# EAGLE design Amplifier2450 (EAGLE 9.6.2)
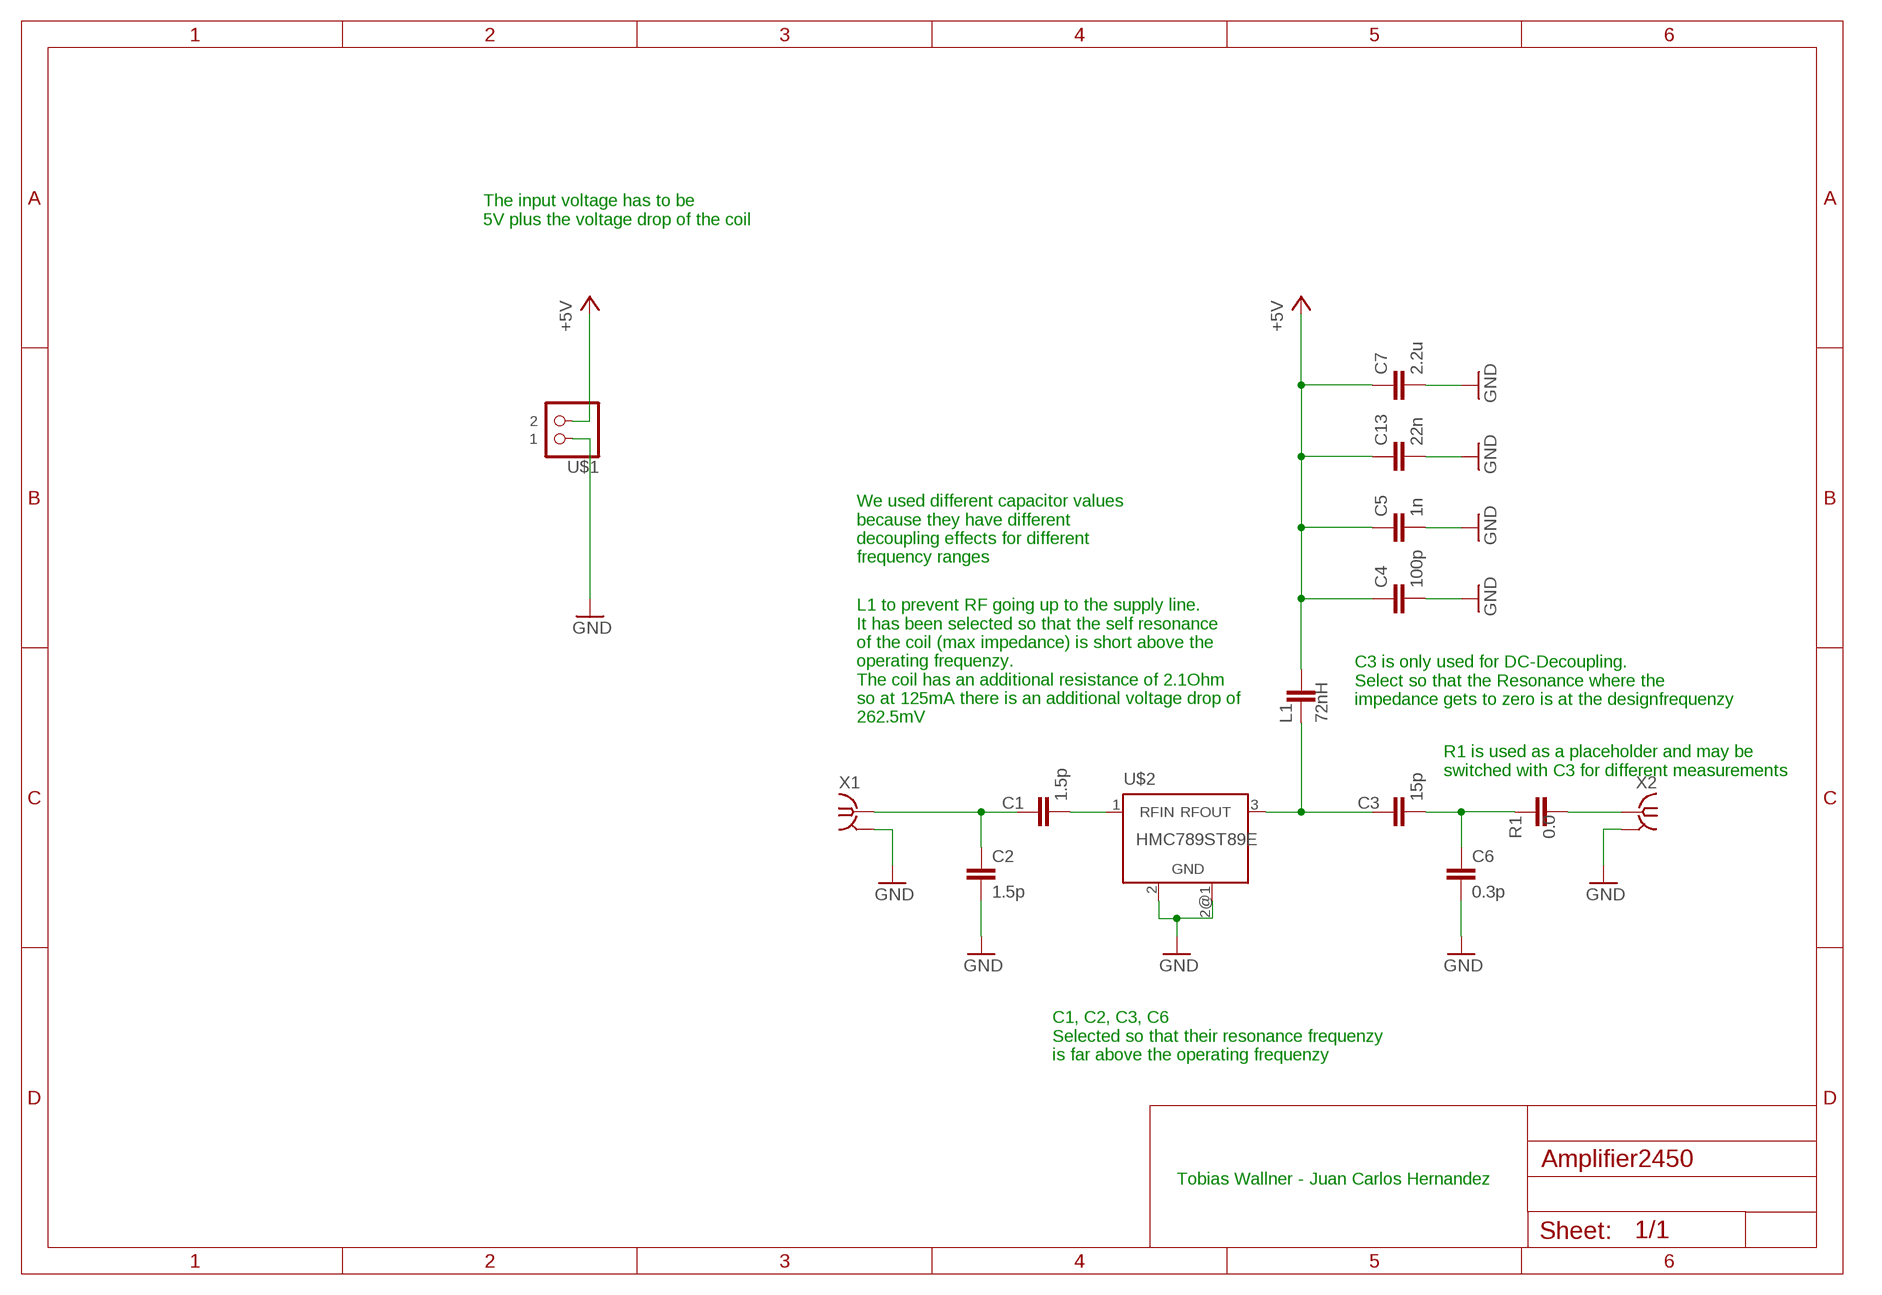
[diagram p0: schematic, sheet 1]

## Parts
C1  1.5p  C-EUC0603  [C0603]
C2  1.5p  C-EUC0603  [C0603]
C3  15p  C-EUC0603  [C0603]
C4  100p  C-EUC0603  [C0603]
C5  1n  C-EUC0603  [C0603]
C6  0.3p  C-EUC0603  [C0603]
C7  2.2u  C-EUC0805  [C0805]
C13  22n  C-EUC0603  [C0603]
L1  72nH  C-EUC0603  [C0603]
R1  0.0  C-EUC0603  [C0603]
U$1  SKB_1X02_RM_5.12  [RM_5.12_1X02]
U$2  HMC789ST89E  [SOT89]
X1  SMA-142-0701-801/806  [J502-ND-142-0701-801/806]
X2  SMA-142-0701-801/806  [J502-ND-142-0701-801/806]

## Nets
+5V: C4.1 C5.1 C7.1 C13.1 L1.1 U$1.P$2
GND: C2.2 C4.2 C5.2 C6.2 C7.2 C13.2 U$1.P$1 U$2.2(GND) U$2.2@1(GND) X1.G@1 X1.G@2 X1.G@3 X1.G@4 X2.G@1 X2.G@2 X2.G@3 X2.G@4
N$1: C3.1 L1.2 U$2.3(RFOUT)
N$2: C1.1 C2.1 X1.1
N$3: C1.2 U$2.1(RFIN)
N$4: C3.2 C6.1 R1.1
N$5: R1.2 X2.1

## Notes on the sheet
- The input voltage has to be 
  5V plus the voltage drop of the coil
- We used different capacitor values 
  because they have different 
  decoupling effects for different
  frequency ranges
- C3 is only used for DC-Decoupling.
  Select so that the Resonance where the
  impedance gets to zero is at the designfrequenzy
- L1 to prevent RF going up to the supply line.
  It has been selected so that the self resonance 
  of the coil (max impedance) is short above the
  operating frequenzy.
  The coil has an additional resistance of 2.1Ohm
  so at 125mA there is an additional voltage drop of 
  262.5mV
- R1 is used as a placeholder and may be
  switched with C3 for different measurements
- C1, C2, C3, C6
  Selected so that their resonance frequenzy
  is far above the operating frequenzy
- Tobias Wallner - Juan Carlos Hernandez

## Library data of the parts
C1-C7 C13 L1 R1 = rcl:C-EU: CAPACITOR, European symbol; SPICEPREFIX: C
U$1 = own_Schraubklemmblock:SKB_1X02; RM: 5.12
U$2 = HMC789ST89E:HMC789ST89E
X1 X2 = con-coax:SMA-: SMA 50 Ohm End Launch Jack Receptacle - Round Contact Johnson Components Source: www.johnsoncomponents.com .. J502-ND.pdf; MF: JOHNSON COMPONENTS; MPN: 142-0701-801; OC_FARNELL: 1608592; OC_NEWARK: 90F2624

## Board
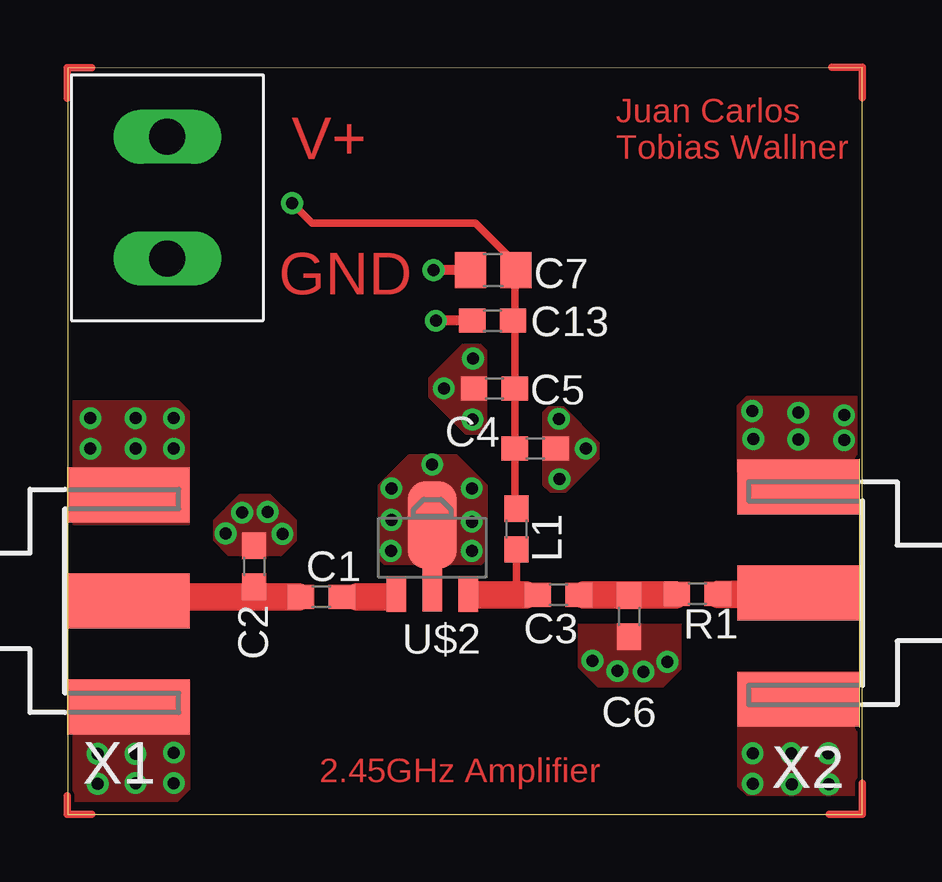
[diagram p1: board, top side]
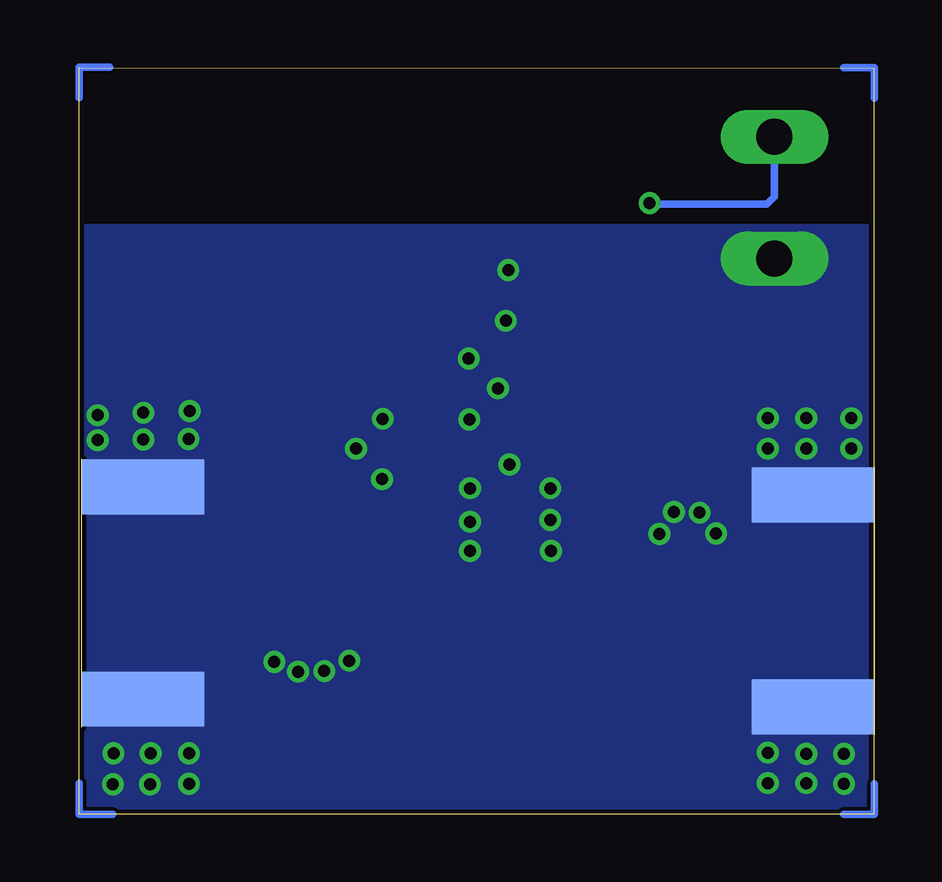
[diagram p2: board, bottom side, seen from below]

Size 33.15 x 31.13 mm. Coordinates in mm from the lower left corner, seen from the top.
Outline: 0.02,0 33.15,0 33.15,31.13 0.02,31.11 0.02,0
Copper layers (1*16): Top 0.035mm / dielectric 1.5mm / Bottom 0.035mm
Design rules "default *": minimum track width 6mil, minimum drill 0.35mm, track to track 6mil, track to pad 6mil, pad to pad 6mil, via to via 6mil, smd to smd 6mil, copper to edge 0.2mm, drill to drill 6mil, minimum pad ring 10mil, minimum via ring 8mil, stop-mask expansion 4mil, vias tented up to drill 0mil, thermal gap 0mil

### Footprints (pad centres in the part's own frame; a part is rotated, then mirrored left to right if it is on the bottom)
C0603 = smd 1.1 x 1: 1 -0.85,0; 2 0.85,0
C0805 = smd 1.3 x 1.5: 1 -0.95,0; 2 0.95,0
RM_5.12_1X02 = drill 1.5 long: P$1 -2.54,0; P$2 2.54,0
SOT89 = smd 0.8 x 1.4: 1 -1.499,-1.981; 3 1.499,-1.981 | smd 0.8 x 1.9: 2 0,-1.727 | smd 2.032 x 3.65: 2@1 0,0.94
J502-ND-142-0701-801/806 = smd 5.08 x 2.286: 1 2.565,0; G@1 2.565,4.42; G@2 2.565,-4.42 | smd 5.08 x 2.286 bottom: G@3 2.565,4.42; G@4 2.565,-4.42

### Placement (x,y rotation side)
C1  10.59,9.07 0 top
C2  7.8,10.34 90 top
C3  20.47,9.14 0 top
C4  19.51,15.24 0 top
C5  17.81,17.75 180 top
C6  23.42,8.26 270 top
C7  17.75,22.68 180 top
C13  17.73,20.57 180 top
L1  18.72,11.89 270 top
R1  26.26,9.19 0 top
U$1  4.17,25.7 90 top
U$2  15.21,11.13 0 top
X1  0,8.89 0 top
X2  33.05,9.22 180 top

### Tracks (layer width: path | path; a pad name or v marks a point on that pad's centre or on a via)
+5V  (via drill 0.5)
  Top 0.305: v9.37,25.48 10.21,24.64 17.02,24.64 18.62,23.04 18.62,22.7 C7.1 18.66,22.63 18.66,20.53 | C13.1 18.66,20.5 C5.1 C4.1 18.66,12.8 L1.1
  Top 0.508: 18.66,20.53 C13.1
  Bottom 0.305: U$1.P$2 4.17,25.76 4.5,25.43 9.32,25.43 v9.37,25.48
GND  (via drill 0.5)
  Top 0.254: U$2.2 15.21,10.82 15.09,10.95
  Top 0.406: C7.2 v15.26,22.68 | C13.2 v15.37,20.57
  other vias: 2.84,16.51 0.97,16.51 0.97,15.24 2.84,15.24 4.45,16.51 4.45,15.24 1.27,2.51 2.84,2.51 4.45,2.57 4.45,1.3 2.84,1.3 1.27,1.27 6.6,11.71 8.97,11.68 8.36,12.6 7.29,12.57 25.02,6.35 21.89,6.4 22.94,5.97 24.03,5.94 21.62,15.24 20.5,16.48 20.52,13.97 16.92,19 15.7,17.75 16.89,16.46 28.6,15.65 32.38,15.6 30.48,15.62 32.38,16.64 30.48,16.74 28.55,16.81 28.57,2.54 30.18,2.54 31.72,2.54 31.75,1.24 30.2,1.24 28.57,1.27 15.21,14.58 13.51,13.59 13.51,12.27 13.49,10.97 16.87,10.97 16.87,12.19 16.87,13.59
  pour Bottom: -1.27,24.54 -1.27,18.87 -1.27,-1.24 33.91,-1.24 33.91,24.54
  pour Top: 27.94,14.25 27.94,17.04 28.32,17.42 33.32,17.42 33.35,17.4 33.35,14.25
  pour Top: 27.94,3.84 27.94,1.17 28.32,0.79 32.89,0.79 33.15,1.04 33.15,3.84
  pour Top: 5.11,5.59 5.11,1.04 4.57,0.51 -0.25,0.51 -0.25,5.59
  pour Top: -0.05,12.06 -0.05,17.25 4.65,17.25 5.08,16.81 5.08,12.06
  pour Top: 9.55,11.4 9.55,12.24 8.46,13.34 7.19,13.34 6.07,12.22 6.07,11.43 6.71,10.79 8.94,10.79
  pour Top: 13.21,10.41 17.27,10.41 17.53,10.67 17.53,13.72 16.26,14.99 14.22,14.99 12.95,13.72 12.95,10.67
  pour Top: 21.29,7.92 25.6,7.92 25.6,6.05 24.84,5.28 22.12,5.28 21.29,6.12
  pour Top: 17.5,19.33 17.25,19.58 16.46,19.58 15.06,18.19 15.06,17.48 15.06,17.4 16.59,15.88 16.61,15.85 17.25,15.85 17.5,16.1 17.5,18.24
  pour Top: 19.84,16.76 20.07,16.99 20.68,16.99 22.17,15.49 22.17,14.81 20.78,13.41 20.14,13.41 19.84,13.72
N$1
  Top 0.305: L1.2 18.72,9.45 | C3.1 19.13,9.14
  Top 0.508: 18.72,9.45 18.41,9.14 | U$2.3 17.25,9.14
  Top 1.143: 17.25,9.14 18.41,9.14 | 18.41,9.14 | 19.13,9.14
  Top 1.147: 19.13,9.14 18.41,9.14
N$2
  Top 0.305: X1.1 2.74,9.07
  Top 0.508: C1.1 9.65,9.07 | C2.1 7.8,9.25 7.62,9.07
  Top 1.143: 2.74,9.07 3.81,9.07 7.62,9.07 9.65,9.07
N$3
  Top 0.305: C1.2 12.09,9.07
  Top 0.508: U$2.1 12.98,9.07 13.54,9.07
  Top 1.147: 12.09,9.07 13.54,9.07
N$4
  Top 0.305: 23.46,9.14 24.13,9.14
  Top 0.508: R1.1 25.36,9.14 25.35,9.14 | C3.2 21.54,9.14 | C6.1 23.46,9.14
  Top 1.143: 21.54,9.14 23.46,9.14 | 23.5,9.14 24.13,9.14 25.35,9.14
N$5
  Top 0.508: R1.2 27.13,9.2 27.15,9.17
  Top 1.143: X2.1 30.48,9.17
  Top 1.147: 27.15,9.17 30.48,9.17
N$6
  Top 0.305: 0,0.76 0,0 1.02,0
N$7
  Top 0.305: 33.15,1.29 33.15,0 31.77,0
N$8
  Top 0.305: 31.88,31.14 33.15,31.14 33.15,29.87
N$9
  Top 0.305: 1.02,31.11 0,31.11 0,29.84
N$12
  Bottom 0.305: 0,1.27 0,0 1.27,0
N$13
  Bottom 0.305: 33.15,1.29 33.15,0 31.75,0
N$14
  Bottom 0.305: 0,29.84 0,31.11 1.27,31.11
N$15
  Bottom 0.305: 33.15,31.11 33.15,29.87
N$16
  Bottom 0.305: 33.15,31.14 31.88,31.14

### Text on the board
Top: V+ | Juan Carlos / Tobias Wallner | GND | 2.45GHz Amplifier
Document: Have power lines close to each other to / reduce noise captured in their spanning area | Multiple Vias to ground / to reduce resistance and inductance of / the vias | * Power line width at 12mil resulting Impedance is ~98Ohm / * Power Reflectance to the signal line is about 10% = ((Z_s - Z_p) / (Z_s - Z_p))^2 / * Heat increase of the powerline at 130mA will be less than 2 Kelvin | Spread Vias around C6 for sliding | Multiple vias on C4 and C5, event though they / are only at DC, to reduce the inductive / effects because they have very small capazitive / values | Measurements are im mm | Disable thermals around pads / and vias, because they would / introduce additional small wire inductors.